# Altium project Arduino_Car.PrjPcb
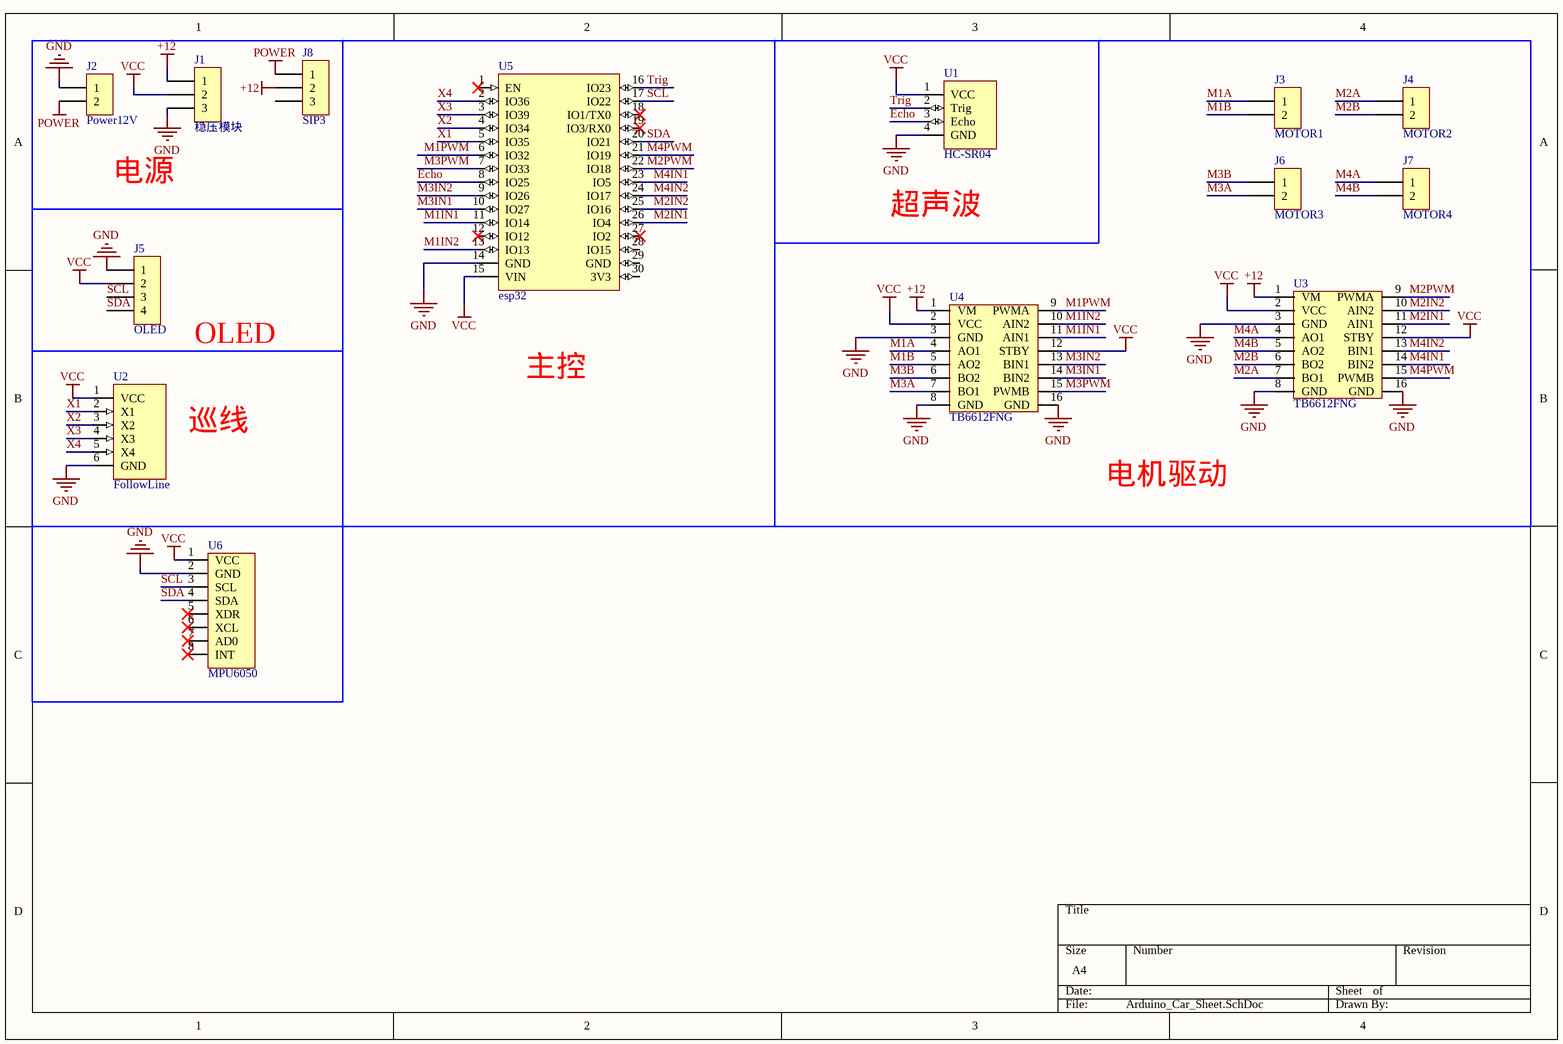
[diagram p0: Arduino_Car_Sheet.SchDoc]
1 sheet, 14 parts. Net scope: global (net labels, ports and power ports of the same name join across sheets).
Board file: PCB1.PcbDoc

## Sheet Arduino_Car_Sheet.SchDoc
size A4

### Parts
J1  稳压模块  [SIP3]
J2  Power12V  [XH2.54-WS-2P]
J3  MOTOR1  [XH2.54-WS-2P]
J4  MOTOR2  [XH2.54-WS-2P]
J5  OLED  [SIP_4P-P2.54-V-F]
J6  MOTOR3  [XH2.54-WS-2P]
J7  MOTOR4  [XH2.54-WS-2P]
J8  SIP3  [SS-12D10]
U1  HC-SR04  [SIP_4P-P2.54-V-F]
U2  FollowLine  [XH2.54-WS-6P]
U3  TB6612FNG  [TB6612FNG]
U4  TB6612FNG  [TB6612FNG]
U5  esp32  [ESP32]
U6  MPU6050  [SIP8]

### Blocks framed on the sheet
电源: J1 J2 J8

### Nets
+12: J1.1 J8.2 U3.1(VM) U4.1(VM)
GND: J1.3 J2.1 J5.1 U1.4(GND) U2.6(GND) U3.3(GND) U3.8(GND) U3.16(GND) U4.3(GND) U4.8(GND) U4.16(GND) U5.14(GND) U6.2(GND)
POWER: J2.2 J8.1
VCC: J1.2 J5.2 U1.1(VCC) U2.1(VCC) U3.2(VCC) U3.12(STBY) U4.2(VCC) U4.12(STBY) U5.15(VIN) U6.1(VCC)
Echo: U1.3(Echo) U5.8(IO25)
M1A: J3.1 U4.4(AO1)
M1B: J3.2 U4.5(AO2)
M1IN1: U4.11(AIN1) U5.11(IO14)
M1IN2: U4.10(AIN2) U5.13(IO13)
M1PWM: U4.9(PWMA) U5.6(IO32)
M2A: J4.1 U3.7(BO1)
M2B: J4.2 U3.6(BO2)
M2IN1: U3.11(AIN1) U5.26(IO4)
M2IN2: U3.10(AIN2) U5.25(IO16)
M2PWM: U3.9(PWMA) U5.22(IO18)
M3A: J6.2 U4.7(BO1)
M3B: J6.1 U4.6(BO2)
M3IN1: U4.14(BIN2) U5.10(IO27)
M3IN2: U4.13(BIN1) U5.9(IO26)
M3PWM: U4.15(PWMB) U5.7(IO33)
M4A: J7.1 U3.4(AO1)
M4B: J7.2 U3.5(AO2)
M4IN1: U3.14(BIN2) U5.23(IO5)
M4IN2: U3.13(BIN1) U5.24(IO17)
M4PWM: U3.15(PWMB) U5.21(IO19)
SCL: J5.3 U5.17(IO22) U6.3(SCL)
SDA: J5.4 U5.20(IO21) U6.4(SDA)
Trig: U1.2(Trig) U5.16(IO23)
X1: U2.2(X1) U5.5(IO35)
X2: U2.3(X2) U5.4(IO34)
X3: U2.4(X3) U5.3(IO39)
X4: U2.5(X4) U5.2(IO36)

Not connected (* = marked no-connect by the designer): J8 3; U5 1(EN)* 12(IO12)* 18(IO1/TX0)* 19(IO3/RX0)* 27(IO2)* 28(IO15) 29(GND) 30(3V3); U6 5(XDR)* 6(XCL)* 7(AD0)* 8(INT)*

### Notes on the sheet
- 超声波
- OLED
- 主控
- 巡线
- 电机驱动

### Library data of the parts
J1 J8 = SIP3: jointbar
J2-J4 J6 J7 = SIP2: jointbar
J5 = SIP4: jointbar
U5 = ESP32NodeMcu-32S